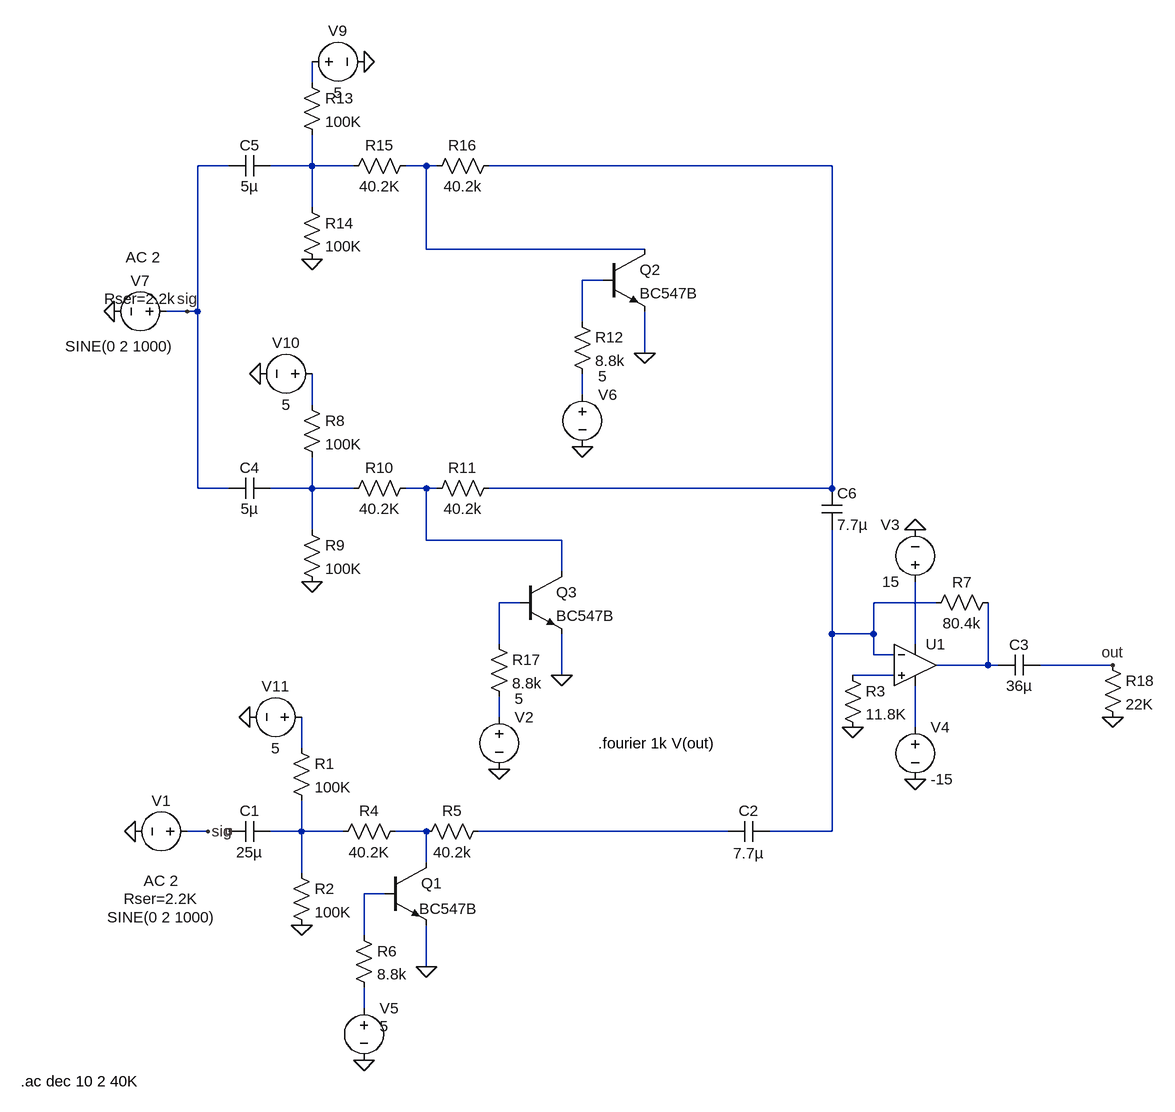
[diagram p0: schematic indgangsvaelger.asc]
indgangsvaelger.asc, the LTspice schematic file:
Version 4
SHEET 1 900 864
WIRE -608 -688 -608 -720
WIRE -736 -560 -784 -560
WIRE -608 -560 -608 -608
WIRE -608 -560 -672 -560
WIRE -544 -560 -608 -560
WIRE -432 -560 -464 -560
WIRE -416 -560 -432 -560
WIRE 192 -560 -336 -560
WIRE -608 -496 -608 -560
WIRE -432 -432 -432 -560
WIRE -96 -432 -432 -432
WIRE -160 -384 -192 -384
WIRE -800 -336 -832 -336
WIRE -784 -336 -784 -560
WIRE -784 -336 -800 -336
WIRE -192 -320 -192 -384
WIRE -96 -272 -96 -336
WIRE -192 -208 -192 -240
WIRE -608 -192 -608 -240
WIRE -784 -64 -784 -336
WIRE -736 -64 -784 -64
WIRE -608 -64 -608 -112
WIRE -608 -64 -672 -64
WIRE -544 -64 -608 -64
WIRE -432 -64 -464 -64
WIRE -416 -64 -432 -64
WIRE 192 -64 192 -560
WIRE 192 -64 -336 -64
WIRE -608 0 -608 -64
WIRE -432 16 -432 -64
WIRE -224 16 -432 16
WIRE -224 64 -224 16
WIRE -288 112 -320 112
WIRE 352 112 256 112
WIRE 192 160 192 0
WIRE 256 160 256 112
WIRE 256 160 192 160
WIRE -320 176 -320 112
WIRE 320 176 320 80
WIRE 256 192 256 160
WIRE 288 192 256 192
WIRE 432 208 432 112
WIRE 432 208 352 208
WIRE 448 208 432 208
WIRE 624 208 512 208
WIRE -224 224 -224 160
WIRE 288 224 224 224
WIRE -320 288 -320 256
WIRE 320 304 320 240
WIRE -624 336 -624 288
WIRE -768 464 -800 464
WIRE -624 464 -624 416
WIRE -624 464 -672 464
WIRE -560 464 -624 464
WIRE -432 464 -480 464
WIRE 32 464 -352 464
WIRE 192 464 192 160
WIRE 192 464 96 464
WIRE -432 512 -432 464
WIRE -624 528 -624 464
WIRE -496 560 -528 560
WIRE -528 624 -528 560
WIRE -432 672 -432 608
WIRE -528 736 -528 704
FLAG -432 672 0
FLAG 320 384 0
FLAG 320 0 0
FLAG 224 304 0
FLAG -528 816 0
FLAG -624 608 0
FLAG -880 464 0
FLAG -96 -272 0
FLAG -192 -128 0
FLAG -608 80 0
FLAG -608 -416 0
FLAG -912 -336 0
FLAG 624 288 0
FLAG -528 -720 0
FLAG -688 -240 0
FLAG -704 288 0
FLAG 624 208 out
FLAG -224 224 0
FLAG -320 368 0
FLAG -768 464 sig
FLAG -800 -336 sig
SYMBOL cap 96 448 R90
WINDOW 0 0 32 VBottom 0
WINDOW 3 34 32 VTop 0
SYMATTR InstName C2
SYMATTR Value 7.7µ
SYMBOL cap 512 192 R90
WINDOW 0 0 32 VBottom 0
WINDOW 3 32 32 VTop 0
SYMATTR InstName C3
SYMATTR Value 36µ
SYMBOL res -640 320 R0
SYMATTR InstName R1
SYMATTR Value 100K
SYMBOL res -640 512 R0
SYMATTR InstName R2
SYMATTR Value 100K
SYMBOL res 208 208 R0
SYMATTR InstName R3
SYMATTR Value 11.8K
SYMBOL res -576 480 R270
WINDOW 0 32 56 VTop 0
WINDOW 3 0 56 VBottom 0
SYMATTR InstName R4
SYMATTR Value 40.2K
SYMBOL res -448 480 R270
WINDOW 0 32 56 VTop 0
WINDOW 3 0 56 VBottom 0
SYMATTR InstName R5
SYMATTR Value 40.2k
SYMBOL res -544 608 R0
SYMATTR InstName R6
SYMATTR Value 8.8k
SYMBOL res 448 96 R90
WINDOW 0 0 56 VBottom 0
WINDOW 3 32 56 VTop 0
SYMATTR InstName R7
SYMATTR Value 80.4k
SYMBOL voltage -784 464 R90
WINDOW 0 -32 56 VBottom 0
WINDOW 3 116 56 VTop 0
WINDOW 123 60 56 VTop 0
WINDOW 39 88 56 VTop 0
SYMATTR InstName V1
SYMATTR Value SINE(0 2 1000)
SYMATTR Value2 AC 2
SYMATTR SpiceLine Rser=2.2K
SYMBOL voltage 320 96 R180
WINDOW 0 24 104 Left 0
WINDOW 3 24 16 Left 0
WINDOW 123 0 0 Left 0
WINDOW 39 0 0 Left 0
SYMATTR InstName V3
SYMATTR Value 15
SYMBOL voltage 320 288 R0
WINDOW 123 0 0 Left 0
WINDOW 39 0 0 Left 0
SYMATTR InstName V4
SYMATTR Value -15
SYMBOL voltage -528 720 R0
WINDOW 123 0 0 Left 0
WINDOW 39 0 0 Left 0
WINDOW 3 24 44 Left 0
SYMATTR Value 5
SYMATTR InstName V5
SYMBOL Opamps\\UniversalOpamp2 320 208 R0
SYMATTR InstName U1
SYMBOL npn -496 512 R0
WINDOW 3 53 71 Left 0
SYMATTR Value BC547B
SYMATTR InstName Q1
SYMBOL cap -672 -80 R90
WINDOW 0 0 32 VBottom 0
WINDOW 3 32 32 VTop 0
SYMATTR InstName C4
SYMATTR Value 5µ
SYMBOL res -624 -208 R0
SYMATTR InstName R8
SYMATTR Value 100K
SYMBOL res -624 -16 R0
SYMATTR InstName R9
SYMATTR Value 100K
SYMBOL res -448 -80 R90
WINDOW 0 0 56 VBottom 0
WINDOW 3 32 56 VTop 0
SYMATTR InstName R10
SYMATTR Value 40.2K
SYMBOL res -320 -80 R90
WINDOW 0 0 56 VBottom 0
WINDOW 3 32 56 VTop 0
SYMATTR InstName R11
SYMATTR Value 40.2k
SYMBOL res -208 -336 R0
SYMATTR InstName R12
SYMATTR Value 8.8k
SYMBOL voltage -192 -224 R0
WINDOW 3 24 -12 Left 0
WINDOW 123 0 0 Left 0
WINDOW 39 0 0 Left 0
SYMATTR Value 5
SYMATTR InstName V6
SYMBOL npn -160 -432 R0
SYMATTR InstName Q2
SYMATTR Value BC547B
SYMBOL cap -672 -576 R90
WINDOW 0 0 32 VBottom 0
WINDOW 3 32 32 VTop 0
SYMATTR InstName C5
SYMATTR Value 5µ
SYMBOL res -624 -704 R0
SYMATTR InstName R13
SYMATTR Value 100K
SYMBOL res -624 -512 R0
SYMATTR InstName R14
SYMATTR Value 100K
SYMBOL res -448 -576 R90
WINDOW 0 0 56 VBottom 0
WINDOW 3 32 56 VTop 0
SYMATTR InstName R15
SYMATTR Value 40.2K
SYMBOL res -320 -576 R90
WINDOW 0 0 56 VBottom 0
WINDOW 3 32 56 VTop 0
SYMATTR InstName R16
SYMATTR Value 40.2k
SYMBOL voltage -816 -336 R90
WINDOW 0 -32 56 VBottom 0
WINDOW 3 69 88 VBottom 0
WINDOW 123 -68 52 VBottom 0
WINDOW 39 -4 56 VBottom 0
SYMATTR InstName V7
SYMATTR Value SINE(0 2 1000)
SYMATTR Value2 AC 2
SYMATTR SpiceLine Rser=2.2k
SYMBOL res 608 192 R0
SYMATTR InstName R18
SYMATTR Value 22K
SYMBOL voltage -624 -720 R270
WINDOW 0 32 56 VTop 0
WINDOW 3 -32 56 VBottom 0
WINDOW 123 0 0 Left 0
WINDOW 39 0 0 Left 0
SYMATTR InstName V9
SYMATTR Value 5
SYMBOL voltage -592 -240 R90
WINDOW 0 -32 56 VBottom 0
WINDOW 3 32 56 VTop 0
WINDOW 123 0 0 Left 0
WINDOW 39 0 0 Left 0
SYMATTR InstName V10
SYMATTR Value 5
SYMBOL voltage -608 288 R90
WINDOW 0 -32 56 VBottom 0
WINDOW 3 32 56 VTop 0
WINDOW 123 0 0 Left 0
WINDOW 39 0 0 Left 0
SYMATTR InstName V11
SYMATTR Value 5
SYMBOL res -336 160 R0
SYMATTR InstName R17
SYMATTR Value 8.8k
SYMBOL voltage -320 272 R0
WINDOW 3 24 -12 Left 0
WINDOW 123 0 0 Left 0
WINDOW 39 0 0 Left 0
SYMATTR Value 5
SYMATTR InstName V2
SYMBOL npn -288 64 R0
SYMATTR InstName Q3
SYMATTR Value BC547B
SYMBOL cap -736 480 R270
WINDOW 0 32 32 VTop 0
WINDOW 3 0 32 VBottom 0
SYMATTR InstName C1
SYMATTR Value 25µ
SYMBOL cap 176 -64 R0
SYMATTR InstName C6
SYMATTR Value 7.7µ
TEXT -1056 848 Left 0 !.ac dec 10 2 40K
TEXT -168 328 Left 0 !.fourier 1k V(out)

The netlist it stands for:
* indgangsvaelger.asc
C2 N011 N020 7.7µ
C3 out N013 36µ
R1 N017 N018 100K
R2 N018 0 100K
R3 N014 0 11.8K
R4 N018 N019 40.2K
R5 N019 N020 40.2k
R6 N021 N022 8.8k
R7 N013 N011 80.4k
V1 sig 0 SINE(0 2 1000) AC 2 Rser=2.2K
V3 N012 0 15
V4 N016 0 -15
V5 N022 0 5
XU1 N014 N011 N012 N016 N013 level.2 Avol=1Meg GBW=10Meg Slew=10Meg ilimit=25m rail=0 Vos=0 phimargin=45 en=0 enk=0 in=0 ink=0 Rin=500Meg  ; pins IN+ IN- V+ V- OUT
Q1 N019 N021 0 0 BC547B
C4 N008 sig 5µ
R8 N007 N008 100K
R9 N008 0 100K
R10 N009 N008 40.2K
R11 N004 N009 40.2k
R12 N005 N006 8.8k
V6 N006 0 5
Q2 N003 N005 0 0 BC547B
C5 N002 sig 5µ
R13 N001 N002 100K
R14 N002 0 100K
R15 N003 N002 40.2K
R16 N004 N003 40.2k
V7 sig 0 SINE(0 2 1000) AC 2 Rser=2.2k
R18 out 0 22K
V9 N001 0 5
V10 N007 0 5
V11 N017 0 5
R17 N010 N015 8.8k
V2 N015 0 5
Q3 N009 N010 0 0 BC547B
C1 NC_01 N018 25µ
C6 N004 N011 7.7µ
.model NPN NPN
.model PNP PNP
.lib standard.bjt
.ac dec 10 2 40K
.fourier 1k V(out)
.lib UniversalOpamps2.sub
.backanno
.end